# Altium schematic sheet USB_Modificado.SchDoc: USB
size A4; DocumentNumber: MB1137; Revision: B-01; SheetNumber: 4; SheetTotal: 6; Project: NUCLEO-XXXXZX
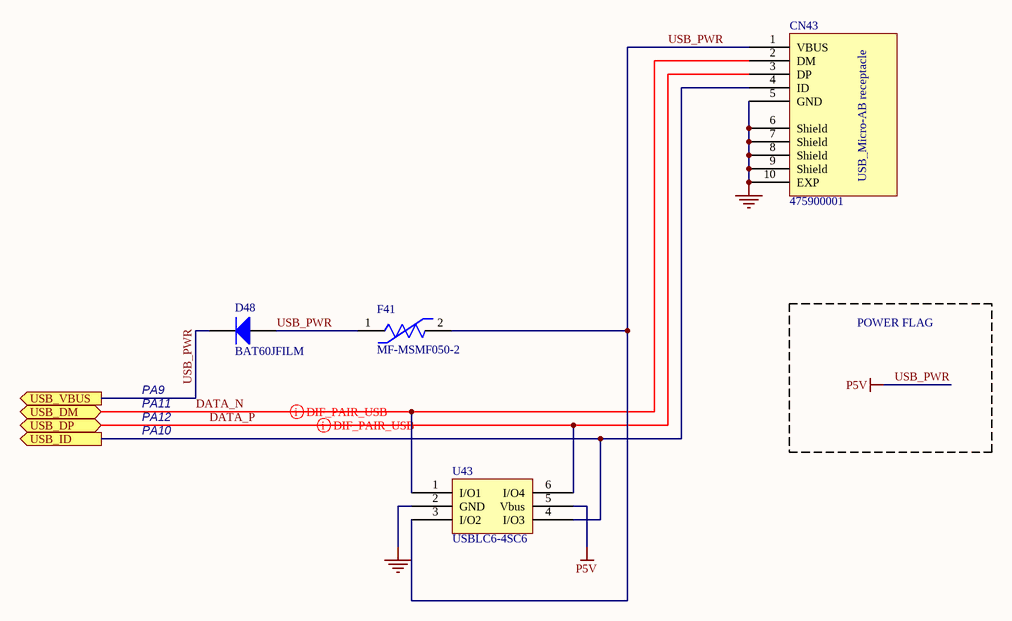
[diagram p0: USB_Modificado.SchDoc]

## Parts
CN43  475900001  [MOLEX_47590001]
D48  BAT60JFILM  [SOD-323]
F41  MF-MSMF050-2  [FP-MF-MSMF050-2-MFG]
U43  USBLC6-4SC6  [SOT23-6L]

## Ports
USB_DM (bidir), USB_DP (bidir), USB_ID (out), USB_VBUS (out)

## Nets
GND: CN43.5(GND) CN43.6(Shield) CN43.7(Shield) CN43.8(Shield) CN43.9(Shield) CN43.10(EXP) U43.2(GND)
USB_PWR: CN43.1(VBUS) D48.1(A) D48.2(K) F41.1 F41.2 U43.3(I/O2) U43.5(Vbus) ; port USB_VBUS  [also labelled P5V]
DATA_N: CN43.2(DM) U43.1(I/O1) ; port USB_DM
DATA_P: CN43.3(DP) U43.6(I/O4) ; port USB_DP
USB_ID: CN43.4(ID) U43.4(I/O3) ; port USB_ID

## Layout directives
differential pair: DATA_N, DATA_P

## Notes on the sheet
- POWER FLAG
- PA9
- PA10
- PA12
- PA11
- Title:
- Project:
- Size:
- Date:
- A4
- Reference:
- Sheet:
- Revision:
- of
- (in symbol 475900001) USB_Micro-AB receptacle

## Library data of the parts
D48 = BAT60JFILM: Manuf_1: STM; Provided: ST; ECCN_US/EU: EAR99/NEC; Revision: July-2002: Re-released for DXP Platform.; Order: BAT60JFILM; Manuf_Part_1: BAT60JFILM; Distrib: ST
F41 = CMP-2100-03653-2: PTC RESET FUSE 15V 500MA 1812; Manufacturer: Bourns; Value: 0.15-1Ω; Trip Current: 1A; Automotive Grade: Grade 3; Trip Time: 0.15s; Current Rating: 100A; Hold Current: 0.5A; Height: 0.85mm; Package: 1812; Voltage Rating: 15V; Temperature Range High: +85°C; Device Class L2: PTC Resettable Fuses; Lead Free: Yes; ComponentLink2URL: http://www.bourns.com/docs/Product-Datasheets/mfmsmf.pdf; Ambient Temperature Range High: +85°C; Mouser Description: PTC Resettable Fuse 0.5A(hold) 1A(trip) 15V 100A 0.8W 0.15s 0.15Ohm SMD Solder Pad 1812 T/R; Digikey Description: PTC RESET FUSE 15V 500MA 1812; Manufacturer Part Number: MF-MSMF050-2; Resistance: 0.15-1Ω; Category: Fuse; ComponentLink2Description: Datasheet; Automotive: Yes; Temperature Range Low: -40°C; RoHS: TRUE; Device Class L1: Circuit Protection; Temperature: -40°C to +85°C; Octopart: https://octopart.com/mf-msmf050-2-bourns-28047; Ambient Temperature Range Low: -40°C; Device Class L3: unset